# Altium schematic sheet 20-AM64x-BootSelect.SchDoc
size A; SheetNumber: 20; SheetTotal: 25
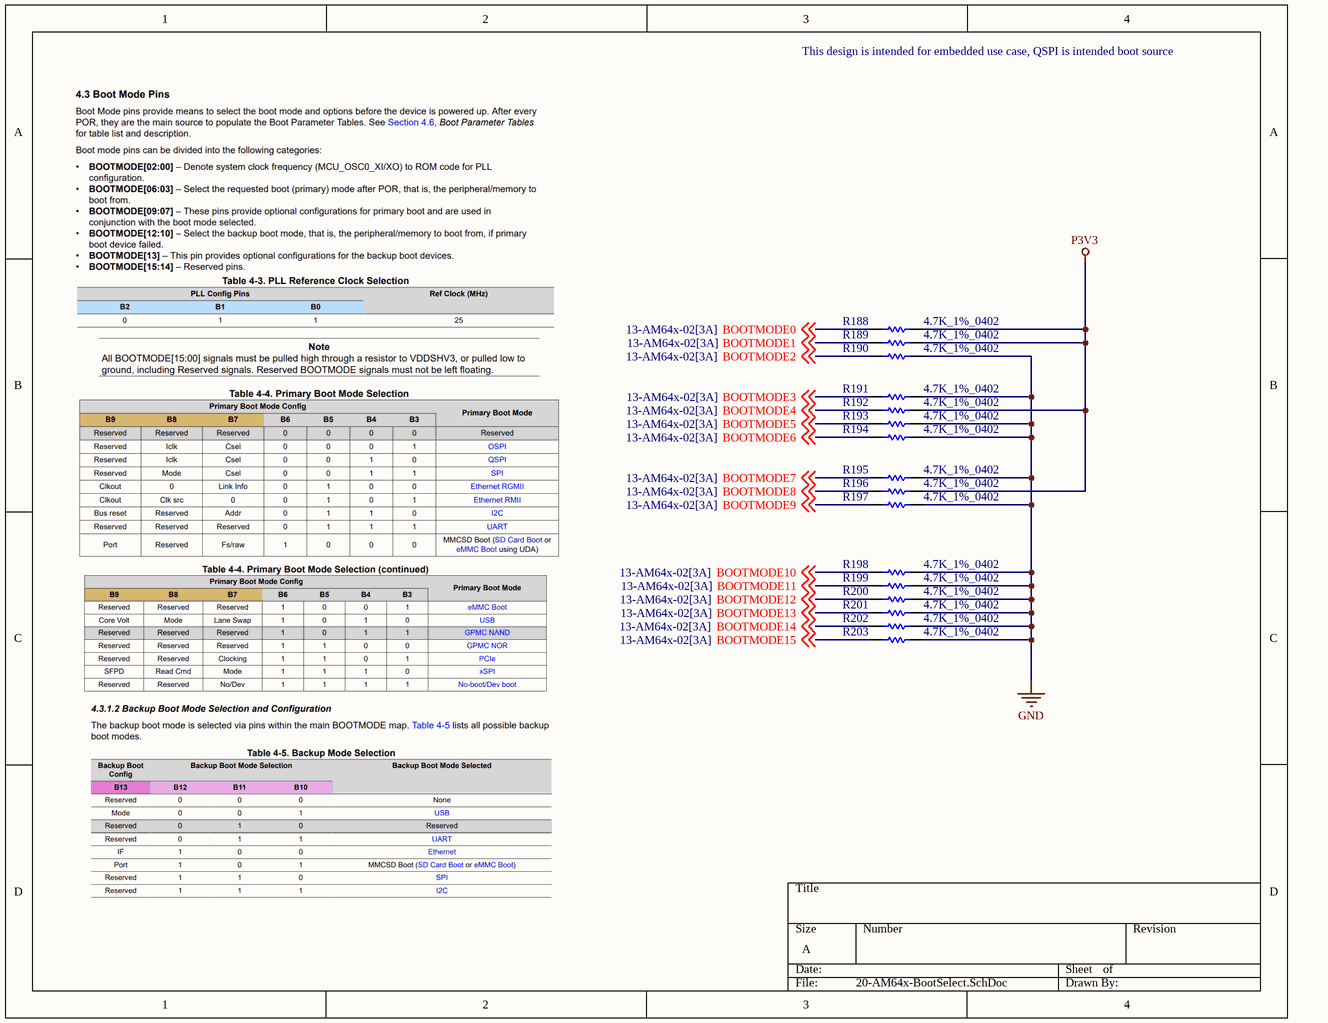
[diagram p0: 20-AM64x-BootSelect.SchDoc]

## Parts
R188  4.7K_1%_0402  [RESC1005X40X25NL10T10]
R189  4.7K_1%_0402  [RESC1005X40X25NL10T10]
R190  4.7K_1%_0402  [RESC1005X40X25NL10T10]
R191  4.7K_1%_0402  [RESC1005X40X25NL10T10]
R192  4.7K_1%_0402  [RESC1005X40X25NL10T10]
R193  4.7K_1%_0402  [RESC1005X40X25NL10T10]
R194  4.7K_1%_0402  [RESC1005X40X25NL10T10]
R195  4.7K_1%_0402  [RESC1005X40X25NL10T10]
R196  4.7K_1%_0402  [RESC1005X40X25NL10T10]
R197  4.7K_1%_0402  [RESC1005X40X25NL10T10]
R198  4.7K_1%_0402  [RESC1005X40X25NL10T10]
R199  4.7K_1%_0402  [RESC1005X40X25NL10T10]
R200  4.7K_1%_0402  [RESC1005X40X25NL10T10]
R201  4.7K_1%_0402  [RESC1005X40X25NL10T10]
R202  4.7K_1%_0402  [RESC1005X40X25NL10T10]
R203  4.7K_1%_0402  [RESC1005X40X25NL10T10]

## Nets
GND: R190.1 R191.1 R193.1 R194.1 R195.1 R197.1 R198.1 R199.1 R200.1 R201.1 R202.1 R203.1
P3V3: R188.1 R189.1 R192.1 R196.1
BOOTMODE0: R188.2 ; off-sheet BOOTMODE0
BOOTMODE1: R189.2 ; off-sheet BOOTMODE1
BOOTMODE2: R190.2 ; off-sheet BOOTMODE2
BOOTMODE3: R191.2 ; off-sheet BOOTMODE3
BOOTMODE4: R192.2 ; off-sheet BOOTMODE4
BOOTMODE5: R193.2 ; off-sheet BOOTMODE5
BOOTMODE6: R194.2 ; off-sheet BOOTMODE6
BOOTMODE7: R195.2 ; off-sheet BOOTMODE7
BOOTMODE8: R196.2 ; off-sheet BOOTMODE8
BOOTMODE9: R197.2 ; off-sheet BOOTMODE9
BOOTMODE10: R198.2 ; off-sheet BOOTMODE10
BOOTMODE11: R199.2 ; off-sheet BOOTMODE11
BOOTMODE12: R200.2 ; off-sheet BOOTMODE12
BOOTMODE13: R201.2 ; off-sheet BOOTMODE13
BOOTMODE14: R202.2 ; off-sheet BOOTMODE14
BOOTMODE15: R203.2 ; off-sheet BOOTMODE15

## Notes on the sheet
- This design is intended for embedded use case, QSPI is intended boot source

## Library data of the parts
R188-R203 = CMP-2002-05217-1: Manufacturer: Bourns; Part Number: CR0402-FX-4701GLF